# EAGLE design synergy-cart (EAGLE 7.7.0)
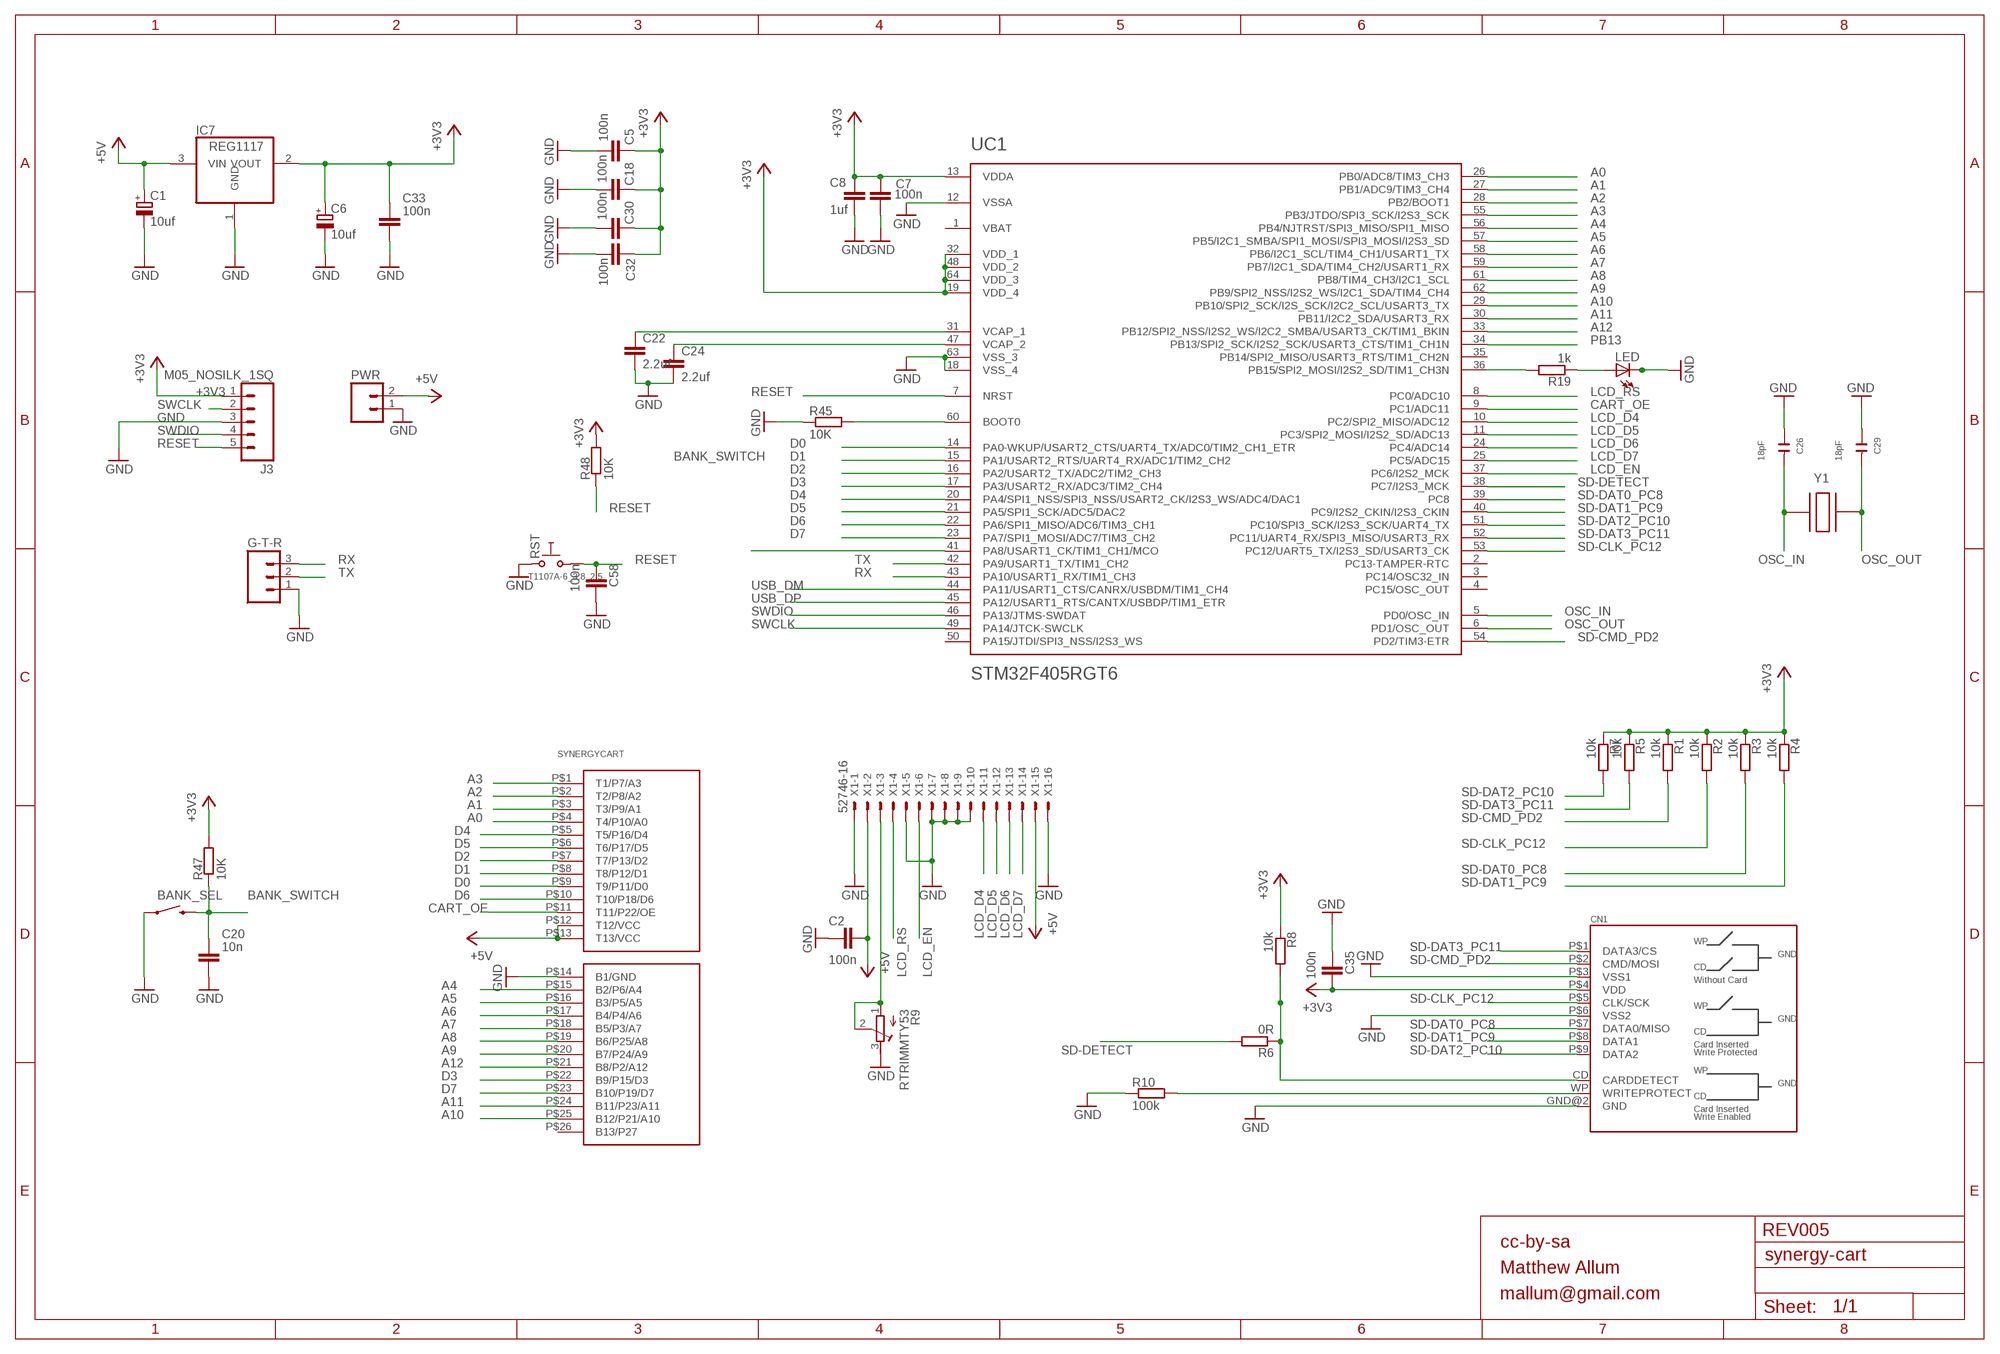
[diagram p0: schematic, sheet 1]

## Parts
BANK_SEL  SWITCH-MOMENTARY-2PTH  [TACTILE-PTH]
C1  10uf  CAPACITOR_POLTANTALUM-CT3216  [CT3216]
C2  100n  CAPACITOR0603  [C0603]
C5  100n  CAPACITOR0603  [C0603]
C6  10uf  CAPACITOR_POLTANTALUM-CT3216  [CT3216]
C7  100n  CAPACITOR0603  [C0603]
C8  1uf  CAPACITOR0603  [C0603]
C18  100n  CAPACITOR0603  [C0603]
C20  10n  CAPACITOR0603  [C0603]
C22  2.2uf  C-EUC0805  [C0805]
C24  2.2uf  C-EUC0805  [C0805]
C26  18pF  C-0603  [C0603]
C29  18pF  C-0603  [C0603]
C30  100n  CAPACITOR0603  [C0603]
C32  100n  CAPACITOR0603  [C0603]
C33  100n  CAPACITOR0603  [C0603]
C35  100n  CAPACITOR0603  [C0603]
C58  100n  CAPACITOR0603  [C0603]
CN1  SDCARD160611  [SDCARD_SMT_AMPH_160611]
G-T-R  M03PTH  [1X03]
IC7  REG1117  [SOT223]
J3  M05_NOSILK_1SQ  [M05_NOSILK_1SQ]
LED  LEDCHIPLED_1206  [CHIPLED_1206]
PWR  M02PTH  [1X02]
R1  10k  RESISTOR0603  [R0603]
R2  10k  RESISTOR0603  [R0603]
R3  10k  RESISTOR0603  [R0603]
R4  10k  RESISTOR0603  [R0603]
R5  10k  RESISTOR0603  [R0603]
R6  0R  RESISTOR0603  [R0603]
R7  10k  RESISTOR0603  [R0603]
R8  10k  RESISTOR0603  [R0603]
R9  RTRIMMTY53  [RTRIMTY53]
R10  100k  RESISTOR0603  [R0603]
R19  1k  RESISTOR0603  [R0603]
R45  10K  RESISTOR0603  [R0603]
R47  10K  RESISTOR0603  [R0603]
R48  10K  RESISTOR0603  [R0603]
RST  T1107A-6_3.8_2.5  SW-TAKT6  [SW-TAKT_6X3.5_SMD]
SYNERGYCART  SYNERGY_CARTSYNER  [SYNERGY_CART]
UC1  STM32F405RGT6  [TQFP-10X10-64]
X1  52746-16  [52746-16]
Y1  CRYSTAL-2  [CRYSTAL-SMD-5.0MM-3.2MM-2]

## Nets
+3V3: C5.1 C6.-(+) C7.1 C8.1 C18.1 C30.1 C32.1 C33.1 C35.1 CN1.P$4(VDD) IC7.2(VOUT) J3.1 R1.1 R2.1 R3.1 R4.1 R5.1 R7.1 R8.1 R47.2 R48.2 UC1.13(VDDA) UC1.19(VDD_4) UC1.32(VDD_1) UC1.48(VDD_2) UC1.64(VDD_3)
+5V: C1.-(+) C2.1 IC7.3(VIN) PWR.2 SYNERGYCART.P$12(T12/VCC) SYNERGYCART.P$13(T13/VCC) X1.2 X1.15
A0: SYNERGYCART.P$4(T4/P10/A0) UC1.26(PB0/ADC8/TIM3_CH3)
A1: SYNERGYCART.P$3(T3/P9/A1) UC1.27(PB1/ADC9/TIM3_CH4)
A2: SYNERGYCART.P$2(T2/P8/A2) UC1.28(PB2/BOOT1)
A3: SYNERGYCART.P$1(T1/P7/A3) UC1.55(PB3/JTDO/SPI3_SCK/I2S3_SCK)
A4: SYNERGYCART.P$15(B2/P6/A4) UC1.56(PB4/NJTRST/SPI3_MISO/SPI1_MISO)
A5: SYNERGYCART.P$16(B3/P5/A5) UC1.57(PB5/I2C1_SMBA/SPI1_MOSI/SPI3_MOSI/I2S3_SD)
A6: SYNERGYCART.P$17(B4/P4/A6) UC1.58(PB6/I2C1_SCL/TIM4_CH1/USART1_TX)
A7: SYNERGYCART.P$18(B5/P3/A7) UC1.59(PB7/I2C1_SDA/TIM4_CH2/USART1_RX)
A8: SYNERGYCART.P$19(B6/P25/A8) UC1.61(PB8/TIM4_CH3/I2C1_SCL)
A9: SYNERGYCART.P$20(B7/P24/A9) UC1.62(PB9/SPI2_NSS/I2S2_WS/I2C1_SDA/TIM4_CH4)
A10: SYNERGYCART.P$25(B12/P21/A10) UC1.29(PB10/SPI2_SCK/I2S_SCK/I2C2_SCL/USART3_TX)
A11: SYNERGYCART.P$24(B11/P23/A11) UC1.30(PB11/I2C2_SDA/USART3_RX)
A12: SYNERGYCART.P$21(B8/P2/A12) UC1.33(PB12/SPI2_NSS/I2S2_WS/I2C2_SMBA/USART3_CK/TIM1_BKIN)
BANK_SWITCH: BANK_SEL.3 C20.1 R47.1 UC1.41(PA8/USART1_CK/TIM1_CH1/MCO)
CART_OE: SYNERGYCART.P$11(T11/P22/OE) UC1.9(PC1/ADC11)
D0: SYNERGYCART.P$9(T9/P11/D0) UC1.14(PA0-WKUP/USART2_CTS/UART4_TX/ADC0/TIM2_CH1_ETR)
D1: SYNERGYCART.P$8(T8/P12/D1) UC1.15(PA1/USART2_RTS/UART4_RX/ADC1/TIM2_CH2)
D2: SYNERGYCART.P$7(T7/P13/D2) UC1.16(PA2/USART2_TX/ADC2/TIM2_CH3)
D3: SYNERGYCART.P$22(B9/P15/D3) UC1.17(PA3/USART2_RX/ADC3/TIM2_CH4)
D4: SYNERGYCART.P$5(T5/P16/D4) UC1.20(PA4/SPI1_NSS/SPI3_NSS/USART2_CK/I2S3_WS/ADC4/DAC1)
D5: SYNERGYCART.P$6(T6/P17/D5) UC1.21(PA5/SPI1_SCK/ADC5/DAC2)
D6: SYNERGYCART.P$10(T10/P18/D6) UC1.22(PA6/SPI1_MISO/ADC6/TIM3_CH1)
D7: SYNERGYCART.P$23(B10/P19/D7) UC1.23(PA7/SPI1_MOSI/ADC7/TIM3_CH2)
GND: BANK_SEL.1 C1.+(-) C2.2 C5.2 C6.+(-) C7.2 C8.2 C18.2 C20.2 C22.2 C24.2 C26.2 C29.2 C30.2 C32.2 C33.2 C35.2 C58.1 CN1.GND@2(GND) CN1.P$3(VSS1) CN1.P$6(VSS2) G-T-R.1 IC7.1(GND) J3.3 LED.C PWR.1 R9.3(E) R10.1 R45.1 RST.P$1 SYNERGYCART.P$14(B1/GND) UC1.12(VSSA) UC1.18(VSS_4) UC1.63(VSS_3) X1.1 X1.5 X1.7 X1.8 X1.9 X1.10 X1.16
LCD_D4: UC1.10(PC2/SPI2_MISO/ADC12) X1.11
LCD_D5: UC1.11(PC3/SPI2_MOSI/I2S2_SD/ADC13) X1.12
LCD_D6: UC1.24(PC4/ADC14) X1.13
LCD_D7: UC1.25(PC5/ADC15) X1.14
LCD_EN: UC1.37(PC6/I2S2_MCK) X1.6
LCD_RS: UC1.8(PC0/ADC10) X1.4
N$1: R19.2 UC1.36(PB15/SPI2_MOSI/I2S2_SD/TIM1_CH3N)
N$2: R45.2 UC1.60(BOOT0)
N$6: CN1.CD(CARDDETECT) R6.1 R8.2
N$7: CN1.WP(WRITEPROTECT) R10.2
N$9: R9.1(A) R9.2(S) X1.3
N$34: LED.A R19.1
N$69: C22.1 UC1.31(VCAP_1)
N$71: C24.1 UC1.47(VCAP_2)
OSC_IN: C26.1 UC1.5(PD0/OSC_IN) Y1.2
OSC_OUT: C29.1 UC1.6(PD1/OSC_OUT) Y1.1
PB13: UC1.34(PB13/SPI2_SCK/I2S2_SCK/USART3_CTS/TIM1_CH1N)
RESET: C58.2 J3.5 R48.1 RST.P$2 UC1.7(NRST)
RX: G-T-R.3 UC1.43(PA10/USART1_RX/TIM1_CH3)
SD-CLK_PC12: CN1.P$5(CLK/SCK) R2.2 UC1.53(PC12/UART5_TX/I2S3_SD/USART3_CK)
SD-CMD_PD2: CN1.P$2(CMD/MOSI) R1.2 UC1.54(PD2/TIM3-ETR)
SD-DAT0_PC8: CN1.P$7(DATA0/MISO) R3.2 UC1.39(PC8)
SD-DAT1_PC9: CN1.P$8(DATA1) R4.2 UC1.40(PC9/I2S2_CKIN/I2S3_CKIN)
SD-DAT2_PC10: CN1.P$9(DATA2) R7.2 UC1.51(PC10/SPI3_SCK/I2S3_SCK/UART4_TX)
SD-DAT3_PC11: CN1.P$1(DATA3/CS) R5.2 UC1.52(PC11/UART4_RX/SPI3_MISO/USART3_RX)
SD-DETECT: R6.2 UC1.38(PC7/I2S3_MCK)
SWCLK: J3.2 UC1.49(PA14/JTCK-SWCLK)
SWDIO: J3.4 UC1.46(PA13/JTMS-SWDAT)
TX: G-T-R.2 UC1.42(PA9/USART1_TX/TIM1_CH2)
USB_DM: UC1.44(PA11/USART1_CTS/CANRX/USBDM/TIM1_CH4)
USB_DP: UC1.45(PA12/USART1_RTS/CANTX/USBDP/TIM1_ETR)
Unconnected: SYNERGYCART.P$26(B13/P27) UC1.2(PC13-TAMPER-RTC) UC1.3(PC14/OSC32_IN) UC1.4(PC15/OSC_OUT) UC1.35(PB14/SPI2_MISO/USART3_RTS/TIM1_CH2N) UC1.50(PA15/JTDI/SPI3_NSS/I2S3_WS)

## Notes on the sheet
- REV005
- cc-by-sa
- Matthew Allum
- mallum@gmail.com

## Power pins joined to a net without a drawn wire
VBAT: UC1.1(VBAT)

## Library data of the parts
BANK_SEL = SparkFun:SWITCH-MOMENTARY-2
C1 C6 = local:CAPACITOR_POL
C2 C35 C58 = local:CAPACITOR
C5 C7 C8 C18 C20 C30 C32 C33 = allum_extras:CAPACITOR
C22 C24 = rcl:C-EU: CAPACITOR, European symbol
C26 C29 = OPL:C*
CN1 = local:SDCARD: SD Card Reader 06132 = Inexpensive SMT 19646 = Push/Pull SMT
G-T-R = SparkFun-Connectors:M03: Header 3 Standard 3-pin 0.1" header. Use with straight break away headers (SKU : PRT-00116), right angle break away headers (PRT-00553), swiss pins (PRT-00743), machine pins (PRT-00117), and female headers (PRT-00115). Molex polarized connector foot print use with SKU : PRT-08232 with associated crimp pins and housings.
IC7 = burr-brown:REG1117: 800mA and 1A Low Dropout (LDO) Positive Regulator 1.8V, 2.5V, 2.85V, 3.3V, 5V, and Adj; MPN: REG1117; OC_FARNELL: 1097566; OC_NEWARK: 14P6981
J3 = flabbergast:M05
LED = adafruit:LED: LED OSRAM: - CHIPLED LG R971, LG N971, LY N971, LG Q971, LY Q971, LO R971, LY R971 LH N974, LH R974 LS Q976, LO Q976, LY Q976 LO Q996 - Hyper CHIPLED LW Q18S LB Q993, LB Q99A, LB R99A - SideLED LS A670, LO A670, LY A670, LG A670, LP A670 LB A673, LV A673, LT A673, LW A673 LH A674 LY A675 LS A676, LA A676, LO A676, LY A676, LW A676 LS A679, LY A679, LG A679 - Hyper Micro SIDELED® LS Y876, LA Y876, LO Y876, LY Y876 LT Y87S - SmartLED LW L88C, LW L88S LB L89C, LB L89S, LG L890 LS L89K, LO L89K, LY L89K LS L896, LA L896, LO L896, LY L896 - TOPLED LS T670, LO T670, LY T670, LG T670, LP T670 LSG T670, LSP T670, LSY T670, LOP T670, LYG T670 LG T671, LOG T671, LSG T671 LB T673, LV T673, LT T673, LW T673 LH T674 LS T676, LA T676, LO T676, LY T676, LB T676, LH T676, LSB T676, LW T676 LB T67C, LV T67C, LT T67C, LS T67K, LO T67K, LY T67K, LW E67C LS E67B, LA E67B, LO E67B, LY E67B, LB E67C, LV E67C, LT E67C LW T67C LS T679, LY T679, LG T679 LS T770, LO T770, LY T770, LG T770, LP T770 LB T773, LV T773, LT T773, LW T773 LH T774 LS E675, LA E675, LY E675, LS T675 LS T776, LA T776, LO T776, LY T776, LB T776 LHGB T686 LT T68C, LB T68C - Hyper Mini TOPLED® LB M676 - Mini TOPLED Santana® LG M470 LS M47K, LO M47K, LY M47K Source: http://www.osram.convergy.de/
PWR = SparkFun-Connectors:M02: Standard 2-pin 0.1" header. Use with - straight break away headers ( PRT-00116) - right angle break away headers (PRT-00553) - swiss pins (PRT-00743) - machine pins (PRT-00117) - female headers (PRT-00115) Molex polarized connector foot print use with: PRT-08233 with associated crimp pins and housings. 2.54_SCREWTERM for use with PRT-10571. 3.5mm Screw Terminal footprints for PRT-08084 5mm Screw Terminal footprints for use with PRT-08432
R1-R8 R10 R19 R45 = local:RESISTOR
R9 = local:RTRIMMTY53
R47 R48 = allum_extras:RESISTOR
RST = gogo:SW-TAKT
SYNERGYCART = local:SYNERGY_CART
UC1 = local:STM32F405RGT6
X1 = con-molex:52746-16: FPC Connector ZIF for SMT 0.5mm Source: http://www.farnell.com/datasheets/73044.pdf [DWG. NO. (Sheet 1 OF 2) SD-52746-**17]; OC_FARNELL: unknown; OC_NEWARK: unknown
Y1 = vovtech:CRYSTAL-2

## Net classes
1 PWR: width 0.203 mm, drill 0.4 mm, clearance 0.076 mm

## Board
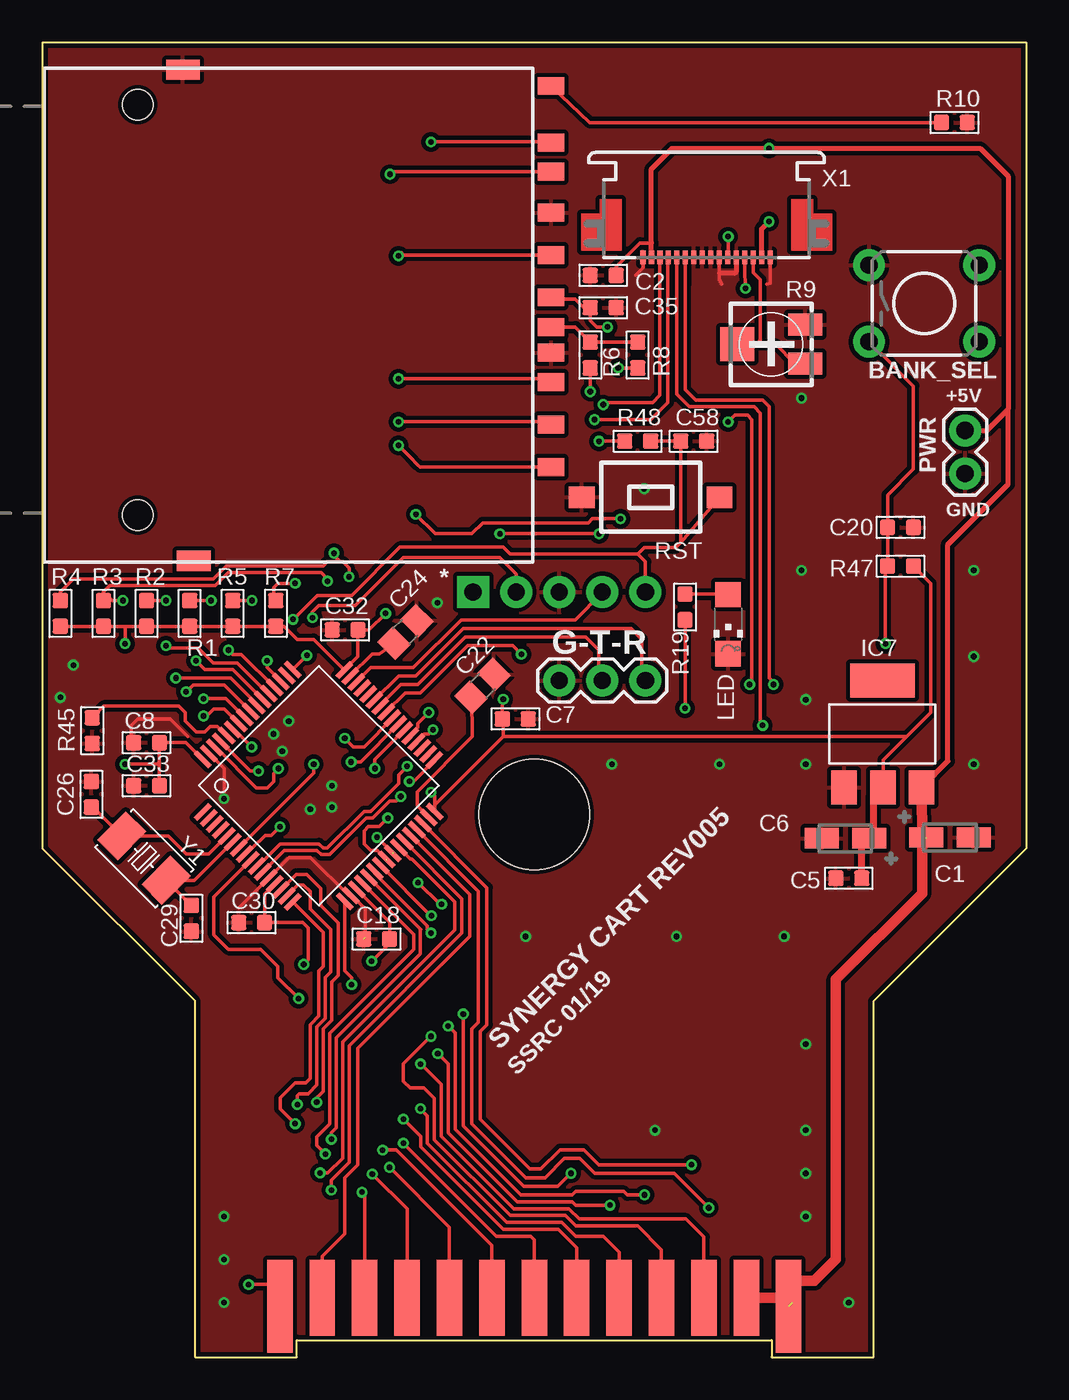
[diagram p1: board, top side]
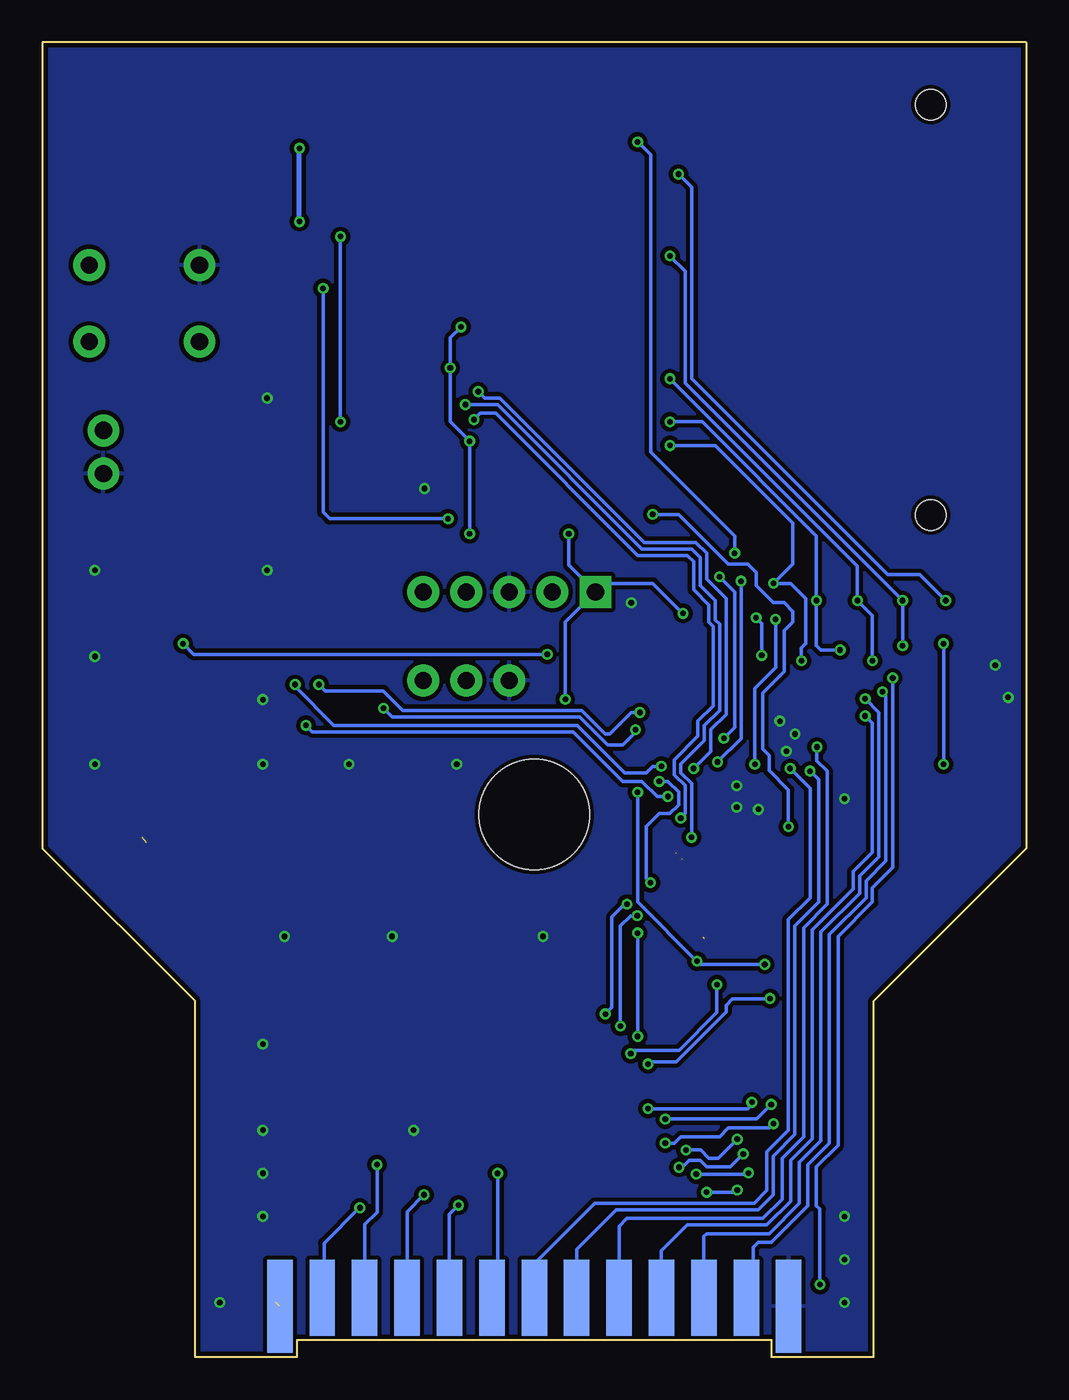
[diagram p2: board, bottom side, seen from below]

Size 58 x 77.54 mm. Coordinates in mm from the lower left corner, seen from the top.
Copper layers (1*16): Top 0.035mm / dielectric 1.5mm / Bottom 0.035mm
Design rules "Fusion_eagle_rule_v1.1": minimum track width 6mil, minimum drill 12mil, track to track 6mil, track to pad 6mil, pad to pad 6mil, via to via 6mil, smd to smd 0mil, copper to edge 10mil, drill to drill 10mil, minimum pad ring 10mil, minimum via ring 6mil, stop-mask expansion 2mil, vias tented up to drill 100mil, thermal gap 10mil

### Footprints (pad centres in the part's own frame; a part is rotated, then mirrored left to right if it is on the bottom)
TACTILE-PTH = drill 1.016 pad 1.88: 1 -3.251,2.261; 2 3.251,2.261; 3 -3.251,-2.261; 4 3.251,-2.261
CT3216 = smd 2 x 1.2: + -1.4,0; - 1.4,0
C0603 = smd 0.889 x 0.889: 1 -0.762,0; 2 0.762,0
C0805 = smd 1.3 x 1.5: 1 -0.95,0; 2 0.95,0
SDCARD_SMT_AMPH_160611 = smd 1.05 x 1.56: CD 1.02,15.47; P$1 6.77,15.47; P$2 4.27,15.47; P$3 2.52,15.47; P$4 -0.73,15.47; P$5 -3.23,15.47; P$6 -5.73,15.47; P$7 -8.15,15.47; P$8 -9.85,15.47; P$9 9.27,15.47; WP -13.2,15.47 | smd 1.2 x 2: GND@1 14.8,-5.6; GND@2 -14.165,-6.235 | hole 1.8: -12.1,-8.9; 12.1,-8.9
1X03 = drill 1.016 pad 1.88: 1 0,0; 2 2.54,0; 3 5.08,0
SOT223 = smd 1.499 x 2.007: 1 -2.261,-3.15; 2 0.025,-3.15; 3 2.311,-3.15 | smd 3.81 x 2.007: 4 0,3.15
M05_NOSILK_1SQ = drill 1.016 pad 1.88 square: 1 -5.08,0 | drill 1.016 pad 1.88: 2 -2.54,0; 3 0,0; 4 2.54,0; 5 5.08,0
CHIPLED_1206 = smd 1.5 x 1.5: A 0,-1.75; C 0,1.75
1X02 = drill 1.016 pad 1.88: 1 0,0; 2 2.54,0
R0603 = smd 0.889 x 0.889: 1 -0.762,0; 2 0.762,0
RTRIMTY53 = smd 1.3 x 2: 1 -1.15,-2; 3 1.15,-2 | smd 2 x 2: 2 0,2
SW-TAKT_6X3.5_SMD = smd 1.27 x 1.524: P$1 0,4.064; P$2 0,-4.064
SYNERGY_CART = smd 1.5 x 5.5: P$1 -15,-18; P$13 15,-18 | smd 1.5 x 4.5: P$2 -12.5,-17.5; P$3 -10,-17.5; P$4 -7.5,-17.5; P$5 -5,-17.5; P$6 -2.5,-17.5; P$7 0,-17.5; P$8 2.5,-17.5; P$9 5,-17.5; P$10 7.5,-17.5; P$11 10,-17.5; P$12 12.5,-17.5 | smd 1.5 x 5.5 bottom: P$14 -15,-18; P$26 15,-18 | smd 1.5 x 4.5 bottom: P$15 -12.5,-17.5; P$16 -10,-17.5; P$17 -7.5,-17.5; P$18 -5,-17.5; P$19 -2.5,-17.5; P$20 0,-17.5; P$21 2.5,-17.5; P$22 5,-17.5; P$23 7.5,-17.5; P$24 10,-17.5; P$25 12.5,-17.5 | hole 6.5: 0,11
TQFP-10X10-64 = smd 1.2 x 0.3: 1 -5.936,3.75; 2 -5.936,3.25; 3 -5.936,2.75; 4 -5.936,2.25; 5 -5.936,1.75; 6 -5.936,1.25; 7 -5.936,0.75; 8 -5.936,0.25; 9 -5.936,-0.25; 10 -5.936,-0.75; 11 -5.936,-1.25; 12 -5.936,-1.75; 13 -5.936,-2.25; 14 -5.936,-2.75; 15 -5.936,-3.25; 16 -5.936,-3.75; 33 5.886,-3.75; 34 5.886,-3.25; 35 5.886,-2.75; 36 5.886,-2.25; 37 5.886,-1.75; 38 5.886,-1.25; 39 5.886,-0.75; 40 5.886,-0.25; 41 5.886,0.25; 42 5.886,0.75; 43 5.886,1.25; 44 5.886,1.75; 45 5.886,2.25; 46 5.886,2.75; 47 5.886,3.25; 48 5.886,3.75 | smd 0.3 x 1.2: 17 -3.75,-5.911; 18 -3.25,-5.911; 19 -2.75,-5.911; 20 -2.25,-5.911; 21 -1.75,-5.911; 22 -1.25,-5.911; 23 -0.75,-5.911; 24 -0.25,-5.911; 25 0.25,-5.911; 26 0.75,-5.911; 27 1.25,-5.911; 28 1.75,-5.911; 29 2.25,-5.911; 30 2.75,-5.911; 31 3.25,-5.911; 32 3.75,-5.911; 49 3.75,5.936; 50 3.25,5.936; 51 2.75,5.936; 52 2.25,5.936; 53 1.75,5.936; 54 1.25,5.936; 55 0.75,5.936; 56 0.25,5.936; 57 -0.25,5.936; 58 -0.75,5.936; 59 -1.25,5.936; 60 -1.75,5.936; 61 -2.25,5.936; 62 -2.75,5.936; 63 -3.25,5.936; 64 -3.75,5.936
52746-16 = smd 0.3 x 0.8: 1 -3.75,0.6; 2 -3.25,0.6; 3 -2.75,0.6; 4 -2.25,0.6; 5 -1.75,0.6; 6 -1.25,0.6; 7 -0.75,0.6; 8 -0.25,0.6; 9 0.25,0.6; 10 0.75,0.6; 11 1.25,0.6; 12 1.75,0.6; 13 2.25,0.6; 14 2.75,0.6; 15 3.25,0.6; 16 3.75,0.6
CRYSTAL-SMD-5.0MM-3.2MM-2 = smd 1.7 x 2.4: 1 -1.85,0; 2 1.85,0

### Placement (x,y rotation side)
BANK_SEL  51.99,62.15 0 top
C1  53.51,30.65 180 top
C2  33.06,63.8 180 top
C5  47.54,28.24 180 top
C6  47.34,30.6 0 top
C7  27.88,37.64 0 top
C8  6.14,36.24 180 top
C18  19.7,24.66 180 top
C20  50.59,48.94 0 top
C22  25.95,39.59 45 top
C24  21.41,42.77 45 top
C26  2.89,33.19 90 top
C29  8.78,25.88 270 top
C30  12.34,25.62 180 top
C32  17.85,42.89 180 top
C33  6.14,33.7 180 top
C35  33.06,61.89 0 top
C58  38.4,54.02 180 top
CN1  14.52,61.77 270 top
G-T-R  30.47,39.9 0 top
IC7  49.52,36.75 0 top
J3  30.47,45.13 0 top
LED  40.43,43.23 180 top
PWR  54.4,52.11 90 top
R1  8.68,43.86 90 top
R2  6.14,43.86 90 top
R3  3.6,43.86 90 top
R4  1.06,43.86 90 top
R5  11.22,43.86 90 top
R6  32.3,59.1 270 top
R7  13.76,43.86 90 top
R8  35.1,59.1 90 top
R9  42.97,59.73 90 top
R10  53.77,72.82 180 top
R19  37.89,44.24 270 top
R45  2.94,36.95 90 top
R47  50.59,46.65 0 top
R48  35.1,54.02 180 top
RST  35.86,50.72 90 top
SYNERGYCART  29,21 0 top
UC1  16.3,33.7 45 top
X1  39.16,65.45 180 top
Y1  5.99,29.43 135 top

### Tracks (layer width: path | path; a pad name or v marks a point on that pad's centre or on a via)
+3V3  (via drill 0.33)
  Top 0.203: UC1.13 13.1,27.32 C30.1 15.36,25.62 15.66,25.32 15.66,23.41 v15.41,23.16 | 27.17,36.6 23.13,32.56 UC1.32 23.13,33.09 v22.9,33.32 | 18.51,27.58 UC1.19 20.47,25.64 C18.1 20.47,24.4 v19.41,23.35 | UC1.64 8.46,36.24 C8.1 6.9,35.1 | UC1.48 17.81,40.44 | v27.17,38.8 27.12,38.37 C7.1 27.17,37.2 27.17,36.6 | 6.9,35.1 6.78,34.97 v4.87,34.97 | C33.1 6.9,35.1 | 50.95,36.6 52.37,38.02 52.37,45.64 R47.2 | 50.95,36.6 49.57,35.22 49.57,33.62 IC7.2 48.99,33.04 | 27.17,36.6 50.95,36.6 | 18.94,43.23 C32.1 18.59,42.87 | UC1.48 17.81,40.54 18.59,41.32 18.59,42.87 | 18.59,42.87 19.25,42.87 v20.24,43.86 | v26.97,48.56 v32.81,48.56 | R4.1 R3.1 4.87,43.1 | 4.87,43.1 R2.1 R1.1 R5.1 R7.1 14.27,43.1 15.03,42.34 15.99,42.34 UC1.48 | v4.87,42.08 4.87,43.1 | v33.32,60.75 32.68,60.75 32.3,61.13 C35.1 31.92,61.89 31.41,62.4 30.09,62.4 CN1.P$4 | R48.2 v32.81,54.02 | R8.1 v33.95,58.34
  Top 0.406: C5.1 48.3,30.4 48.99,30.35 | 48.99,30.35 C6.- | 48.99,33.04 48.99,30.35
  Bottom 0.203: v22.9,33.32 22.9,26.84 v19.41,23.35 19.22,23.16 v15.41,23.16 | v26.97,48.56 26.97,46.7 J3.1 | v20.24,43.86 22.02,45.64 24.88,45.64 J3.1 | v32.81,48.56 v32.81,54.02 33.95,55.16 v33.95,58.34 33.95,60.12 v33.32,60.75 | v27.17,38.8 27.17,43.35 J3.1 | v4.87,34.97 v4.87,42.08
+5V  (via drill 0.33)  (2 unrouted)
  Top 0.203: 35.98,64.77 X1.15 | 35.91,65.7 35.22,65.7 33.83,64.31 C2.1
  Top 0.305: IC7.3 53.38,35.15 53.38,47.92 56.94,51.48 56.94,55.92 | X1.2 42.41,66.54 v42.84,66.97 | X1.15 35.91,65.7 35.91,70.07 37.13,71.29 v42.84,71.29 55.29,71.29 56.94,69.64 56.94,55.92 | PWR.2 55.67,54.66 56.94,55.92
  Top 0.61: SYNERGYCART.P$12 43.96,3.5 44.24,3.22 44.24,4.49 45.51,4.49 46.78,5.76 46.78,22.27 51.86,27.35 51.86,30.32 IC7.3
  Bottom 0.305: v42.84,66.97 v42.84,71.29
A0  (via drill 0.33)
  Top 0.203: SYNERGYCART.P$4 21.5,8.74 v19.45,10.79 | v16.38,10.86 16.83,10.86 17.7,11.73 17.7,18.59 24.3,25.19 24.3,26.84 21.76,29.38 21.68,29.38 UC1.26
  Bottom 0.203: v19.45,10.79 16.45,10.79 v16.38,10.86
A1  (via drill 0.33)
  Top 0.203: SYNERGYCART.P$3 19,9.56 v18.84,9.72 | UC1.27 24.73,27.03 24.73,25.01 18.08,18.36 18.08,11.47 17.04,10.43 v17.04,9.85
  Bottom 0.203: v18.84,9.72 17.16,9.72 v17.04,9.85
A2
  Top 0.203: UC1.28 25.19,27.28 25.19,24.81 18.59,18.21 18.59,11.35 17.82,10.59 17.82,7.28 16.5,5.96 SYNERGYCART.P$2
A3  (via drill 0.33)
  Top 0.203: UC1.55 12.74,38.43 11.12,40.05 v7.87,40.05 | v12.16,4.29 13.56,4.29 13.76,4.49 13.76,3.24 SYNERGYCART.P$1
  Bottom 0.203: v7.87,40.05 7.87,28.87 9.06,27.68 9.06,26.84 11.09,24.81 11.09,12.49 12.36,11.22 12.36,8.93 12.16,8.73 v12.16,4.29
A4  (via drill 0.33)
  Top 0.203: v8.48,39.24 8.88,39.64 10.71,39.64 UC1.56
  Bottom 0.203: SYNERGYCART.P$15 16.5,5.61 16.09,5.61 16.09,6.47 15.79,6.78 15.03,6.78 12.87,8.93 12.87,11.35 11.6,12.62 11.6,24.94 9.44,27.1 9.44,28.09 8.27,29.25 8.27,39.03 v8.48,39.24
A5  (via drill 0.33)
  Top 0.203: v9.49,38.83 10.82,38.83 UC1.57
  Bottom 0.203: SYNERGYCART.P$16 19,7.12 18.84,7.28 15.16,7.28 13.38,9.06 13.38,11.47 12.11,12.74 12.11,25.06 9.82,27.35 9.82,28.37 8.68,29.51 8.68,38.02 v9.49,38.83
A6  (via drill 0.33)
  Top 0.203: v9.49,37.81 9.7,37.81 10.1,38.22 10.72,38.22 UC1.58
  Bottom 0.203: SYNERGYCART.P$17 21.5,6.27 19.98,7.79 15.28,7.79 13.89,9.19 13.89,11.6 12.62,12.87 12.62,25.19 10.2,27.6 10.2,28.64 9.09,29.76 9.09,37.41 v9.49,37.81
A7  (via drill 0.33)
  Top 0.203: UC1.59 11.31,37.01 v12.34,35.99
  Bottom 0.203: SYNERGYCART.P$18 24,7.71 23.54,8.17 15.54,8.17 14.39,9.32 14.39,11.73 13.12,13 13.12,25.32 11.73,26.71 11.73,34.56 12.34,35.17 v12.34,35.99
A8  (via drill 0.33)
  Top 0.203: v12.74,34.56 12.25,34.56 UC1.61
  Bottom 0.203: SYNERGYCART.P$19 26.5,6.35 24.17,8.68 15.79,8.68 14.9,9.57 14.9,11.86 13.63,13.13 13.63,25.44 12.24,26.84 12.24,34.06 v12.74,34.56
A9  (via drill 0.33)
  Top 0.203: UC1.62 10.24,35.95 12.62,33.57 13.25,33.57 13.63,33.95 13.63,34.44 v13.91,34.72
  Bottom 0.203: SYNERGYCART.P$20 29,5.51 25.44,9.06 16.05,9.06 15.28,9.82 15.28,12.11 14.01,13.38 14.01,25.83 12.74,27.1 12.74,33.55 v13.91,34.72
A10  (via drill 0.33)
  Top 0.203: UC1.29 22.09,31.11 22.09,31.09 25.7,27.48 25.7,19.73 25.32,19.35 25.32,13.76 28.49,10.59 29.63,10.59 30.78,11.73 31.67,11.73 32.56,10.84 37.25,10.84 v39.29,8.81
  Bottom 0.203: SYNERGYCART.P$25 41.39,3.6 41.39,6.72 39.31,8.81 v39.29,8.81
A11  (via drill 0.33)
  Top 0.203: v38.27,11.35 32.81,11.35 31.92,12.24 30.52,12.24 29.38,11.09 28.75,11.09 25.82,14.01 25.82,19.22 26.21,19.6 26.21,27.68 UC1.30
  Bottom 0.203: SYNERGYCART.P$24 39,7.82 38.27,8.55 v38.27,11.35
A12  (via drill 0.33)
  Top 0.203: UC1.33 23.11,35.18 21.89,33.95 v21.63,33.95 | v24.81,20.24 24.81,13.63 28.36,10.08 30.4,10.08 v31.16,10.84 | v23.54,26.71 23.41,26.71 v22.14,27.98
  Bottom 0.203: v21.63,33.95 21.13,33.95 20.49,33.32 20.49,32.56 21,32.05 21.63,32.05 22.4,31.29 22.4,28.24 v22.14,27.98 | v24.81,20.24 24.43,20.62 24.43,25.95 23.67,26.71 v23.54,26.71 | v31.16,10.84 31.16,3.84 SYNERGYCART.P$21
BANK_SWITCH  (via drill 0.33)
  Top 0.203: UC1.41 20.29,38.07 21.38,39.16 22.27,39.16 25.06,41.95 27.73,41.95 v28.24,41.45 | v49.7,42.08 49.7,46.53 R47.1 C20.1 49.83,50.84 51.35,52.37 51.35,57.27 BANK_SEL.3
  Bottom 0.203: v28.24,41.45 49.07,41.45 v49.7,42.08
CART_OE  (via drill 0.33)
  Top 0.203: SYNERGYCART.P$11 39,7.09 37.94,8.15 31.64,8.15 31.03,8.76 27.78,8.76 23.51,13.02 23.51,16.07 v22.29,17.29 | UC1.9 10.1,27.15 10.1,24.91 10.97,24.05 12.87,24.05 13.89,23.03 13.89,22.37 v15.11,21.15
  Bottom 0.203: v15.11,21.15 15.13,21.13 17.32,21.13 17.7,20.75 17.7,20.36 20.64,17.42 22.17,17.42 v22.29,17.29
D0  (via drill 0.33)
  Top 0.203: SYNERGYCART.P$9 34,6.2 33.06,7.13 31.44,7.13 30.63,7.94 27.37,7.94 22.7,12.62 22.7,14.24 v22.29,14.65 | UC1.14 14.96,28.47 15.59,28.47 16.4,27.66 16.4,26.64 17.44,25.6 17.44,22.52 17.06,22.14 17.06,19.86 16.55,19.35 16.55,15.67 16.17,15.28 v16.17,15.03
  Bottom 0.203: v22.29,14.65 16.43,14.65 16.17,14.9 v16.17,15.03
D1  (via drill 0.33)
  Top 0.203: SYNERGYCART.P$8 31.5,6.46 30.42,7.54 27.17,7.54 22.29,12.41 22.29,13.02 v21.28,14.04 | UC1.15 15.05,27.86 15.39,27.86 15.79,27.45 15.79,26.44 17.01,25.22 17.01,22.73 16.68,22.4 16.68,19.98 16.17,19.48 16.17,16.05 15.66,15.54 15.16,15.54 15.03,15.41 v15.03,14.9 15.03,15.28
  Bottom 0.203: v21.28,14.04 15.89,14.04 v15.03,14.9
D2  (via drill 0.33)
  Top 0.203: SYNERGYCART.P$7 29,6.93 28.8,7.13 26.77,7.13 v21.28,12.62 | v14.9,13.76 14.01,14.65 14.01,15.28 14.9,16.17 15.54,16.17 15.79,16.43 15.79,19.6 16.3,20.11 16.3,22.78 16.55,23.03 16.55,25.05 UC1.16
  Bottom 0.203: v21.28,12.62 20.75,12.62 20.36,13 18.08,13 17.57,13.51 15.16,13.51 v14.9,13.76
D3  (via drill 0.33)
  Top 0.203: v33.47,8.96 31.44,8.96 31.24,9.16 27.98,9.16 23.92,13.23 23.92,17.29 v23.31,17.9 | v18.23,21.96 18.23,22.37 17.82,22.78 UC1.17
  Bottom 0.203: SYNERGYCART.P$22 34,8.43 v33.47,8.96 | v23.31,17.9 23.11,18.1 20.47,18.1 18.23,20.34 v18.23,21.96
D4  (via drill 0.33)
  Top 0.203: SYNERGYCART.P$5 24,7.66 v20.47,11.2 | UC1.20 21.89,24.93 21.89,24.05 16.93,19.09 16.93,13.76 16.17,13 16.17,12.49 v16.68,11.98
  Bottom 0.203: v20.47,11.2 20.26,11.2 19.86,11.6 19.22,11.6 18.84,11.22 17.44,11.22 v16.68,11.98
D5  (via drill 0.33)
  Top 0.203: SYNERGYCART.P$6 26.5,6.58 20.87,12.21 v20.06,12.21 | UC1.21 22.29,25.23 22.27,25.2 22.27,23.79 17.32,18.84 17.32,13.51 17.04,13.23 v17.04,12.85
  Bottom 0.203: v20.06,12.21 19.2,12.21 18.71,11.73 18.15,11.73 v17.04,12.85
D6  (via drill 0.33)
  Top 0.203: SYNERGYCART.P$10 36.5,6.34 35.1,7.74 31.44,7.74 30.83,8.35 27.58,8.35 23.11,12.82 23.11,15.26 22.5,15.87 21.68,15.87 21.28,16.28 21.28,17.29 v22.9,18.92 | UC1.22 19.6,28.52 22.7,25.42 22.7,25.22 v22.9,25.01
  Bottom 0.203: v22.9,18.92 v22.9,25.01
D7  (via drill 0.33)
  Top 0.203: v35.5,9.57 34.49,9.57 34.28,9.77 31.44,9.77 31.24,9.57 28.19,9.57 24.33,13.43 24.33,19.12 v23.92,19.53 | v22.93,26.03 22.91,26.03 UC1.23
  Bottom 0.203: SYNERGYCART.P$23 36.5,8.57 v35.5,9.57 | v23.92,19.53 23.92,25.42 23.31,26.03 v22.93,26.03
GND  (via drill 0.33)  (1 unrouted)
  Top 0.203: X1.1 42.91,63.35 42.72,63.29 | 40.94,64.82 X1.5 | X1.7 39.91,63.93 39.91,63.56 40.05,63.29 | X1.16 35.41,64.24 34.97,63.8 | 19.04,24.76 19.04,26.44 18.26,27.22 UC1.18 18.05,27.22 15.79,29.48 14.56,29.48 UC1.12 11.58,26.5 | UC1.63 9.8,35.62 | 9.8,35.67 9.8,35.62 | 9.8,35.62 10.71,34.72 v10.71,32.94 | 8.58,36.6 7.54,37.64 5.63,37.64 5.25,37.26 5.25,36.37 C8.2
  Top 0.305: X1.5 40.91,64.02 40.81,63.93 39.91,63.93
  other vias: 14.52,37.51 13.63,36.75 14.14,35.73 17.06,33.7 17.06,32.43 15.79,32.3 45,34.97 39.92,34.97 33.57,34.97 35.48,51.23 45,38.78 10.71,5.76 23.29,44.49 1.82,40.81 1.06,38.91 10.71,8.3 10.71,3.22 47.54,3.22 45,8.3 45,10.84 45,13.38 45,18.46 54.91,34.97 54.91,46.4 54.91,41.32 28.49,24.81 36.11,13.38 37.38,24.81 43.73,24.81 44.75,46.4 44.75,56.56
  pour Top (isolate 0.254): -2.75,78.15 59.48,78.15 59.48,-3.13 -2.75,-3.13
  pour Bottom (isolate 0.254): -2.75,78.15 58.21,78.15 59.48,29.89 50.59,21 50.59,-1.86 7.41,-1.86 7.41,19.73 -1.48,28.62
LCD_D4  (via drill 0.33)
  Top 0.203: v21.51,34.84 21,34.34 21,33.83 19.35,32.18 18.97,32.18 16.81,30.02 16.55,30.02 16.3,30.27 14.01,30.27 12.71,28.97 UC1.10 | v43.1,39.67 43.1,39.8 42.84,40.05 42.84,56.05 42.46,56.43 38.53,56.43 37.89,57.07 37.89,63.25 37.91,63.27 X1.11
  Bottom 0.203: v21.51,34.84 22.02,34.84 22.4,34.46 23.67,34.46 26.46,37.26 40.81,37.26 43.1,39.54 v43.1,39.67
LCD_D5  (via drill 0.33)
  Top 0.203: v21.13,33.06 20.87,32.81 20.49,32.81 19.47,31.8 19.09,31.8 16.93,29.64 16.43,29.64 16.17,29.89 14.27,29.89 UC1.11 | v42.46,37.26 42.33,37.38 42.33,55.67 41.95,56.05 38.14,56.05 37.41,56.79 X1.12
  Bottom 0.203: v42.46,37.26 42.08,36.88 26.71,36.88 23.79,33.95 22.65,33.95 21.76,33.06 v21.13,33.06
LCD_D6  (via drill 0.33)  (1 unrouted)
  Top 0.203: 20.27,29.34 19.73,29.89 19.35,29.89 18.97,30.27 18.97,31.03 19.22,31.29 19.86,31.29 v20.36,31.8 | 36.87,64.89 X1.13 36.87,64.81 36.87,56.31 35.86,55.29 v32.56,55.29
  Bottom 0.203: v20.36,31.8 20.11,32.05 20.11,33.7 20.75,34.34 20.75,35.22 19.35,36.62 19.35,37.51 18.46,38.4 18.46,43.1 18.71,43.35 18.71,44.37 19.6,45.26 19.6,46.91 19.98,47.29 22.9,47.29 31.29,55.67 32.17,55.67 v32.56,55.29
LCD_D7  (via drill 0.33)  (1 unrouted)
  Top 0.203: 20.66,29.73 v19.73,30.65 | 36.41,64.48 X1.14 36.41,56.73 35.98,56.31 33.19,56.31 v33.06,56.18
  Bottom 0.203: v19.73,30.65 19.73,33.83 20.36,34.46 20.36,34.97 18.97,36.37 18.97,37.26 18.08,38.14 18.08,43.23 18.33,43.48 18.33,44.62 19.22,45.51 19.22,47.16 19.73,47.67 22.65,47.67 31.16,56.18 v33.06,56.18
LCD_EN  (via drill 0.33)
  Top 0.203: UC1.37 21.7,36.69 22.14,37.13 22.14,37.38 v22.78,38.02 | v41.7,39.67 41.7,39.8 41.83,39.92 41.83,55.29 41.57,55.54 40.81,55.54 v40.43,55.16 | 40.43,64.83 X1.6 40.43,64.87 v40.43,66.08
  Bottom 0.203: v22.78,38.02 23.29,38.02 24.55,36.75 24.81,36.75 26.21,38.14 36.75,38.14 37.89,39.29 41.32,39.29 v41.7,39.67 | v40.43,55.16 v40.43,66.08
LCD_RS  (via drill 0.33)
  Top 0.203: v14.01,31.29 13.51,30.78 13.12,30.78 12.36,30.02 12.03,29.68 UC1.8 | X1.4 41.41,64.22 v41.45,63.04 | v34.08,49.45 32.43,49.45 32.17,49.19 25.95,49.19 25.32,48.56 23.16,48.56 v22.02,49.7
  Bottom 0.203: v14.01,31.29 14.01,33.45 15.16,34.59 15.16,35.48 15.54,35.86 15.54,39.16 14.27,40.43 14.27,42.84 13.76,43.35 13.76,43.99 14.27,44.49 14.9,44.49 15.92,45.51 15.92,46.27 16.43,46.78 17.57,46.78 20.49,49.7 v22.02,49.7 | v34.08,49.45 41.06,49.45 41.45,49.83 v41.45,63.04
N$1  (via drill 0.33)
  Top 0.203: UC1.36 22.52,36.75 22.78,36.75 v23.03,37 | v37.89,38.27 R19.2
  Bottom 0.203: v23.03,37 23.03,36.88 23.79,36.11 24.68,36.11 26.33,37.76 37.38,37.76 v37.89,38.27
N$2
  Top 0.203: UC1.60 10.31,37.2 9.9,37.2 9.57,36.88 9.06,36.88 8.43,37.51 8.43,38.02 8.04,38.4 3.62,38.4 R45.2
N$6
  Top 0.203: R8.2 R6.1 31.42,60.75 CN1.CD
N$7
  Top 0.203: R10.2 32.27,72.82 CN1.WP
N$9
  Top 0.203: 41.95,64.89 X1.3 41.91,63.97 42.33,63.55 42.33,59.99 41.95,59.61 40.35,59.61 R9.2 43.22,59.73 44.37,58.59 45.71,58.59 R9.1
N$34
  Top 0.203: R19.1 40.4,45 LED.A
N$69
  Top 0.203: UC1.31 22.29,32.3 22.29,32.33 22.09,32.53 22.09,33.34 25.34,36.6 25.34,37.36 C22.1
N$71
  Top 0.203: UC1.47 18.16,40.19 19.45,41.47 19.86,41.47 C24.1
OSC_IN
  Top 0.203: C26.1 2.99,32.43 Y1.2 7.42,30.74 8.48,29.69 9.81,29.69 UC1.5
OSC_OUT
  Top 0.203: Y1.1 | Y1.1 C29.1 | Y1.1 8.96,28.12 UC1.6
RESET  (via drill 0.33)
  Top 0.203: J3.5 35.55,46.91 35.1,47.36 | 35.1,47.36 27.58,47.36 27.17,47.77 21.07,47.77 18.23,44.93 16.2,44.93 v14.78,43.5 | v16,34.97 16,34.46 UC1.7 | 35.1,47.36 35.48,47.75 37.33,47.75 37.64,48.05 | R48.1 C58.2 37.64,48.05 | 37.64,48.05 RST.P$2
  Bottom 0.203: v14.78,43.5 14.78,40.66 16,39.44 v16,34.97
RX
  Top 0.203: UC1.43 21,40.18 22.02,40.18 24.81,42.97 34.72,42.97 35.35,42.34 35.35,39.95 G-T-R.3
SD-CLK_PC12  (via drill 0.33)
  Top 0.203: UC1.53 13.34,39.2 13.21,39.2 11.47,40.94 10.08,40.94 9.19,41.83 7.41,41.83 v7.28,41.95 | v7.28,44.62 R2.2 | 21.18,65.12 v21,64.94 21.05,65 CN1.P$5
  Bottom 0.203: v7.28,41.95 v7.28,44.62 20.11,57.45 20.11,64.05 v21,64.94
SD-CMD_PD2  (via drill 0.33)
  Top 0.203: UC1.54 11.21,40.56 9.57,40.56 v9.06,41.07 | R1.2 v9.95,44.62 | v21,57.7 29.91,57.7 CN1.P$2
  Bottom 0.203: v21,57.7 9.95,46.65 v9.95,44.62 9.06,43.73 v9.06,41.07
SD-DAT0_PC8  (via drill 0.33)
  Top 0.203: v18.2,35.1 18.76,35.1 UC1.39 | R3.2 3.6,45.13 | v4.74,44.62 4.11,44.62 3.6,45.13 | v16.81,45.77 16.81,45.89 16.43,46.27 10.97,46.27 10.2,45.51 3.98,45.51 3.6,45.13 | CN1.P$7 20.64,69.92 v20.49,69.77
  Bottom 0.203: v16.81,45.77 16.81,36.49 v18.2,35.1 | v20.49,69.77 19.73,69.01 19.73,57.7 8.17,46.15 6.27,46.15 v4.74,44.62
SD-DAT1_PC9  (via drill 0.33)
  Top 0.203: UC1.40 20.64,37.66 18.97,35.99 18.33,35.99 v17.82,36.49 | v18.08,46.02 18.08,46.53 17.7,46.91 17.57,46.91 | v17.19,47.42 17.19,47.29 17.57,46.91 | R4.2 1.06,45.13 1.82,45.89 10.08,45.89 10.84,46.65 16.55,46.65 16.81,46.91 17.57,46.91 | CN1.P$8 29.92,71.67 v22.9,71.67
  Bottom 0.203: v17.82,36.49 17.19,37.13 17.19,45.13 v18.08,46.02 | v22.9,71.67 22.14,70.91 22.14,53.38 17.19,48.43 v17.19,47.42
SD-DAT2_PC10  (via drill 0.33)
  Top 0.203: UC1.51 14.05,39.89 13.25,40.68 v13.25,41.07 | v21,53.77 21.7,53.07 22.14,52.62 22.27,52.5 CN1.P$9 | v14.9,45.64 13.89,45.64 13.63,45.38 13.63,44.75 R7.2
  Bottom 0.203: v21,53.77 18.33,53.77 13.76,49.19 13.76,46.78 v14.9,45.64 13.89,45.64 13,44.75 13,42.08 13.25,41.83 v13.25,41.07
SD-DAT3_PC11  (via drill 0.33)
  Top 0.203: UC1.52 11.73,41.45 11.22,41.45 v10.97,41.7 | v12.36,44.62 R5.2 | v21,55.16 29.95,55.16 CN1.P$1
  Bottom 0.203: v10.97,41.7 12.11,41.7 12.36,41.95 v12.36,44.62 12.36,48.43 19.09,55.16 v21,55.16
SD-DETECT  (via drill 0.33)
  Top 0.203: UC1.38 19.6,35.23 v19.6,34.72 | v32.3,56.94 R6.2
  Bottom 0.203: v19.6,34.72 18.59,35.73 18.59,37 17.7,37.89 17.7,44.75 18.84,45.89 18.84,47.42 19.47,48.05 22.52,48.05 31.03,56.56 31.92,56.56 v32.3,56.94
SWCLK  (via drill 0.33)
  Top 0.203: J3.2 27.93,46.2 26.97,47.16 21.28,47.16 18.43,44.32 16.3,44.32 15.92,43.94 v15.92,43.61 | v15.59,41.38 UC1.49
  Bottom 0.203: v15.59,41.38 15.59,43.28 v15.92,43.61
SWDIO
  Top 0.203: J3.4 33.01,45.08 31.41,43.48 24.68,43.48 21.86,40.66 19.37,40.66 UC1.46
TX
  Top 0.203: UC1.42 19.93,38.47 21.13,39.67 22.14,39.67 24.94,42.46 32.05,42.46 32.81,41.7 32.81,39.95 G-T-R.2

### Text on the board
tNames: +5V | GND | * | SYNERGY CART REV005 | SSRC 01/19